# Altium schematic sheet 1.8V POWER.SchDoc: 1.8V Power
size B; CheckedBy: Lance Bantoto; Engineer: Cindy Li; Organization: Altium Limited; Address1: L3, 12a Rodborough Rd; Address2: Frenchs Forest; Address3: NSW; Address4: Australia 2086; DocumentNumber: 5; Revision: 1; SheetNumber: 5; SheetTotal: 26
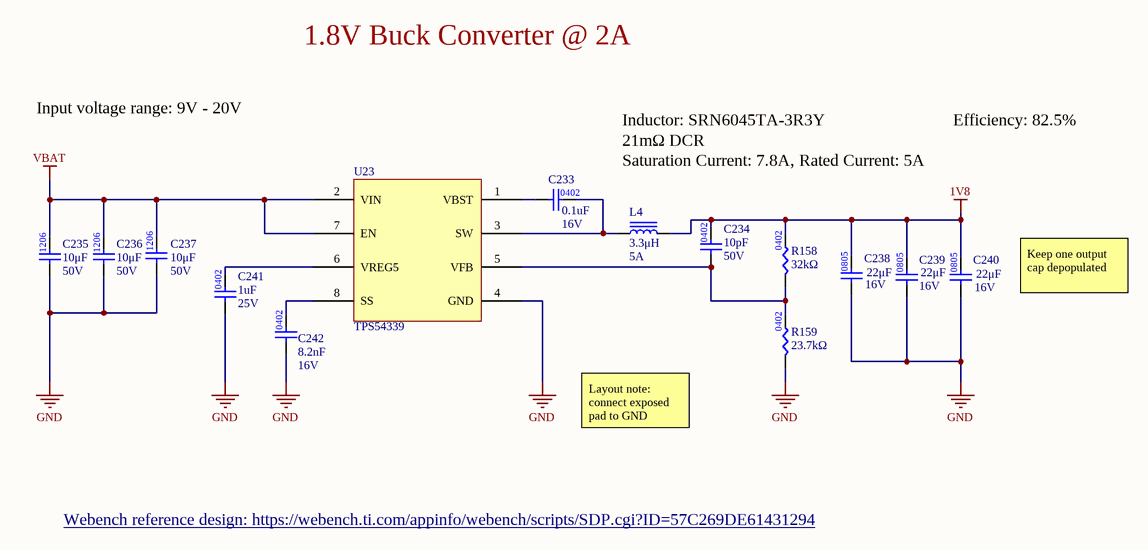
[diagram p0: 1.8V POWER.SchDoc]

## Parts
C233  Rated DC Voltage (URdc): 16V  Capacitance: 0.1uF  [CAP0402]  (hidden comment: CAP_0.1uF_16V_X7R_0402)
C234  Capacitance: 10pF  Voltage: 50V  [CAP0402]  (hidden comment: CAP_10pF_50V_0402)
C235  value 10μF  Voltage Rating: 50V  [CAP1210]  (hidden comment: CAP_10uF_50V_1210)
C236  value 10μF  Voltage Rating: 50V  [CAP1210]  (hidden comment: CAP_10uF_50V_1210)
C237  value 10μF  Voltage Rating: 50V  [CAP1210]  (hidden comment: CAP_10uF_50V_1210)
C238  value 22μF  Voltage Rating: 16V  [CAP2012]  (hidden comment: CAP_22uF_16V_0805)
C239  value 22μF  Voltage Rating: 16V  [CAP2012]  (hidden comment: CAP_22uF_16V_0805)
C240  value 22μF  Voltage Rating: 16V  [CAP2012]  (hidden comment: CAP_22uF_16V_0805)
C241  Capacitance: 1uF  Voltage: 25V  [CAP0402]  (hidden comment: CAP_1uF_25V_0402)
C242  Capacitance: 8.2nF  Voltage: 16V  [CAP0402]  (hidden comment: CAP_8.2nF_16V_0402)
L4  Current Rating: 5A  Inductance: 3.3μH  [IND_SRN6045TA-3R3Y]  (hidden comment: IND_3.3uH_5A)
R158  value 32kΩ  [RES0402]  (hidden comment: RES_32kΩ_0402_1%)
R159  value 23.7kΩ  [RES0402]  (hidden comment: RES_23.7kΩ_0402_1%)
U23  TPS54339  [VREG_LM5017MR/NOPB]

## Nets
1V8: C234.2 C238.2 C239.2 C240.2 L4.2 R158.2
GND: C235.1 C236.1 C237.1 C238.1 C239.1 C240.1 C241.1 C242.1 R159.1 U23.4(GND)
VBAT: C235.2 C236.2 C237.2 U23.2(VIN) U23.7(EN)
NetC233_1: C233.1 U23.1(VBST)
NetC233_2: C233.2 L4.1 U23.3(SW)
NetC234_1: C234.1 R158.1 R159.2 U23.5(VFB)
NetC241_2: C241.2 U23.6(VREG5)
NetC242_2: C242.2 U23.8(SS)

## Notes on the sheet
- 1.8V Buck Converter @ 2A
- Input voltage range: 9V - 20V
- Inductor: SRN6045TA-3R3Y
- Efficiency: 82.5%
- 21mΩ DCR
- Saturation Current: 7.8A, Rated Current: 5A
- Keep one output cap depopulated
- Layout note: connect exposed pad to GND
- Webench reference design: https://webench.ti.com/appinfo/webench/scripts/SDP.cgi?ID=57C269DE61431294 <https://webench.ti.com/appinfo/webench/scripts/SDP.cgi?ID=57C269DE61431294>
- Title:
- Project:
- Date:
- Rev:
- Reviewer:
- Engineer:
- Sheet:
- of
- (in symbol CAP_10uF_50V_1210) 1206

## Library data of the parts
C233 = CAP_0.1uF_16V_X7R_0402: Ceramic Capacitor, Ceramic; Manufacturer: Taiyo Yuden; Manufacturer Part Number: LMK212AC6106MD-T; Multilayer: Yes; Negative Tolerance: 10%; Temperature Characteristics Code: X7R; Supplier 1: Digi-Key; Supplier Part Number 1: 587-6337-1-ND; RoHS: Yes; Stock 1: 703; Pricing 1: 1=0.29000, 10=0.20100, 50=0.12060, 100=0.10180, 500=0.06966, 1000=0.06163 (USD); ComponentLink1URL: https://datasheet.ciiva.com:443/pdfs/VipMasterIC/IC/TAIY/TAIY-S-A0009099504/TAIY-S-A0009099407-1.pdf?src-supplier=IHS+Markit; ComponentLink1Description: https://datasheet.ciiva.com:443/pdfs/VipMasterIC/IC/TAIY/TAIY-S-A0009099504/TAIY-S-A0009099407-1.pdf?src-supplier=IHS+Markit; ComponentLink2URL: https://ds.yuden.co.jp/TYCOMPAS/ut/detail?pn=LMK212AC6106MD-T &amp;u=M&src-supplier=Digi-Key; ComponentLink2Description: https://ds.yuden.co.jp/TYCOMPAS/ut/detail?pn=LMK212AC6106MD-T &amp;u=M&src-supplier=Digi-Key; Supplier 2: Digi-Key; Supplier Part Number 2: 1292-1630-1-ND; Category: Ceramic Capacitors; Stock 2: 20327886; Pricing 2: 1=0.10000, 10=0.02800, 50=0.01500, 100=0.01220, 500=0.00876, 1000=0.00688, 2500=0.00625, 5000=0.00575 (USD); Mount: Surface Mount; Number of Pins: 2; Dielectric Material: Ceramic; Package Shape: Rectangular; Terminal Finish: Nickel; Min Operating Temperature: -55°C; Max Operating Temperature: 125°C; JESD-609 Code: e3; Capacitor Type: Ceramic; Package Style: SMTMeter; Packaging: Tape and Reel; Positive Tolerance: 10%; Termination: Wraparound; Length: 1mm; Width: 0.5mm; Height: 0.5mm; REACH SVHC: Yes; RoHS Compliant: Yes; ComponentLink3URL: https://datasheet.ciiva.com:443/pdfs/VipMasterIC/IC/WATC/WATC-S-A0009550342/WATC-S-A0009550342-1.pdf?src-supplier=IHS+Markit; ComponentLink3Description: https://datasheet.ciiva.com:443/pdfs/VipMasterIC/IC/WATC/WATC-S-A0009550342/WATC-S-A0009550342-1.pdf?src-supplier=IHS+Markit; ComponentLink4URL: http://www.farnell.com/datasheets/2340522.pdf?src-supplier=Farnell; ComponentLink4Description: http://www.farnell.com/datasheets/2340522.pdf?src-supplier=Farnell; ComponentLink5URL: http://components.arrow.com/part/dataview/0323_00654690?src-supplier=Arrow+Europe; ComponentLink5Description: http://components.arrow.com/part/dataview/0323_00654690?src-supplier=Arrow+Europe; ComponentLink6URL: https://www.verical.com/server-webapp/html/getDatasheet?partID=415228&src-supplier=Verical; ComponentLink6Description: https://www.verical.com/server-webapp/html/getDatasheet?partID=415228&src-supplier=Verical; ComponentLink7URL: http://www.passivecomponent.com/indexsea/0402B104K160CT-IN.pdf?src-supplier=Digi-Key; ComponentLink7Description: http://www.passivecomponent.com/indexsea/0402B104K160CT-IN.pdf?src-supplier=Digi-Key; ComponentLink8URL: http://www.passivecomponent.com/wp-content/uploads/2018/10/MLCC.pdf?src-supplier=Digi-Key; ComponentLink8Description: http://www.passivecomponent.com/wp-content/uploads/2018/10/MLCC.pdf?src-supplier=Digi-Key; ComponentLink9URL: http://www.farnell.com/datasheets/2340522.pdf?src-supplier=Element14; ComponentLink9Description: http://www.farnell.com/datasheets/2340522.pdf?src-supplier=Element14; ComponentLink10URL: http://www.farnell.com/datasheets/2340522.pdf?src-supplier=Newark; ComponentLink10Description: http://www.farnell.com/datasheets/2340522.pdf?src-supplier=Newark; Size Code: 0402; Supplier 3: Digi-Key; Supplier Part Number 3: 445-173645-1-ND; Stock 3: 3627; Pricing 3: 1=0.20000, 10=0.14200, 50=0.08080, 100=0.06700, 500=0.04696, 1000=0.03888, 2500=0.03619, 5000=0.03311 (USD); ComponentLink11URL: https://datasheet.ciiva.com:443/pdfs/VipMasterIC/IC/TDKC/TDKC-S-A0007785269/TDKC-S-A0007785269-1.pdf?src-supplier=IHS+Markit; ComponentLink11Description: https://datasheet.ciiva.com:443/pdfs/VipMasterIC/IC/TDKC/TDKC-S-A0007785269/TDKC-S-A0007785269-1.pdf?src-supplier=IHS+Markit; ComponentLink12URL: https://product.tdk.com/info/en/catalog/spec/mlccspec_commercial_soft_en.pdf?src-supplier=Digi-Key; ComponentLink12Description: https://product.tdk.com/info/en/catalog/spec/mlccspec_commercial_soft_en.pdf?src-supplier=Digi-Key
C234 = CAP_10pF_50V_0402: Ceramic Capacitor, Multilayer, Ceramic, 50V, 1% +Tol, 1% -Tol, C0G, 30ppm/Cel TC, 0.00001uF, Surface Mount, 0402; Package: 0402
C235-C237 = CAP_10uF_50V_1210: CAP CER 10UF 50V X7R 1210; Manufacturer 1: Murata Electronics; Manufacturer Part Number 1: GRM32ER71H106MA12L; Dielectric: X7R; Supplier 1: Digi-Key; Supplier Part Number 1: 490-12775-1-ND
C238-C240 = CAP_22uF_16V_0805: CAP CER 22UF 16V X5R 0805; Manufacturer 1: Murata Electronics; Manufacturer Part Number 1: GRM219R61C226ME15L; Package/Footprint: 0805; Supplier 1: Digi-Key; Supplier Part Number 1: 490-9952-1-ND; Mounting Type: SMD; Dielectric: X5R
C241 = CAP_1uF_25V_0402: ±10% 25V Ceramic Capacitor X5R 0402 (1005 Metric); Manufacturer 1: TDK Corporation; Manufacturer Part Number 1: C1005X5R1E105K050BE; Supplier 1: Digi-Key; Supplier Part Number 1: 445-175215-1-ND; Package: 0402
C242 = CAP_8.2nF_16V_0402: 8200 pF ±10% 16V Ceramic Capacitor X7R 0402 (1005 Metric); Manufacturer 1: Yageo; Manufacturer Part Number 1: CC0402KRX7R7BB822; Supplier 1: Digi-Key; Supplier Part Number 1: 311-1041-1-ND; Package: 0402
L4 = IND_3.3uH_5A: FIXED IND 3.3UH 5A 21 MOHM SMD; Manufacturer 1: Bourns Inc.; Manufacturer Part Number 1: SRN6045TA-3R3Y; DC Resistance (DCR): 21mOhm; Inductance Tolerance: 30%; Saturation Current: 7.8A; Test Frequency: 1MHz; Mounting Type: SMD; Supplier 1: Digi-Key; Supplier Part Number 1: SRN6045TA-3R3YCT-ND
R158 = RES_32kΩ_0402_1%: RES 32K OHM 1% 1/16W 0402; Manufacturer 1: Vishay Dale; Manufacturer Part Number 1: RN73H1ETTP3202F50; Package/Footprint: 0402; Supplier 1: Digi-Key; Supplier Part Number 1: 2019-RN73H1ETTP3202F50CT-ND; Tolerance: 1%
R159 = RES_23.7kΩ_0402_1%: RES 23.7K OHM 1% 1/16W 0402; Manufacturer Part Number 1: RMCF0402FT23K7; Manufacturer 1: Stackpole Electronics Inc; Power: 0.063W, 1/16W; Package/Footprint: 0402; Supplier 1: Digi-Key; Supplier Part Number 1: RMCF0402FT23K7CT-ND; Mounting Type: SMD; Tolerance: 1%
U23 = TPS54339: IC REG BUCK ADJUSTABLE 3A 8SOPWR; Manufacturer 1: Texas Instruments; Manufacturer Part Number 1: TPS54339DDAR; Input Voltage (Min): 4.5V; Input Voltage (Max): 23V; Output Voltage (Min/Fixed): 0.76V; Output Voltage (Max): 7V; Switching Frequency: 600kHz; Supplier 1: Digi-Key; Supplier Part Number 1: 296-35686-1-ND; Output Current: 3A; Package: 8-PowerSOIC